# EAGLE schematic F (EAGLE 9.6.2)
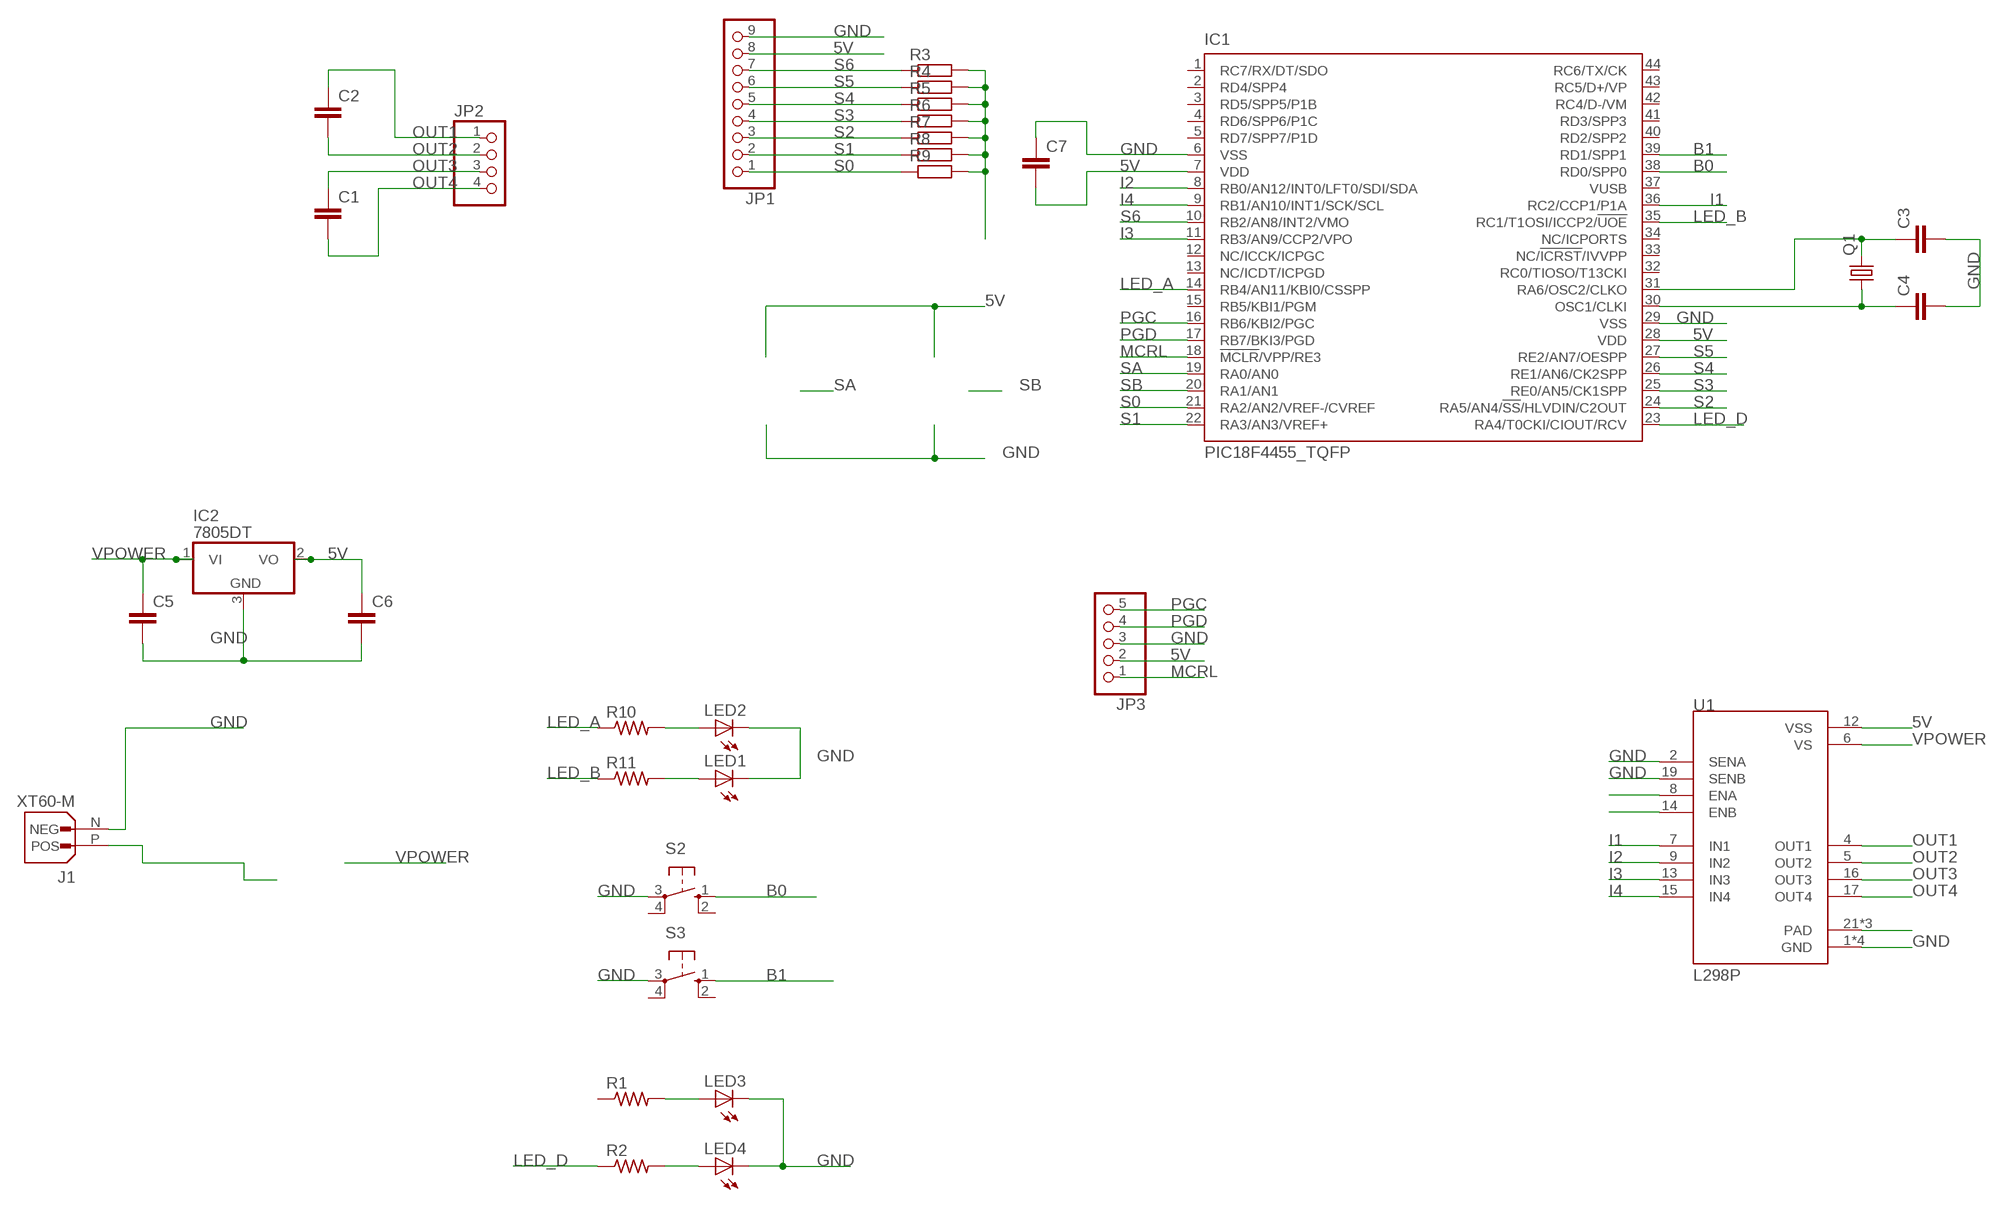
[diagram p0: schematic, sheet 1]

## Parts
C1  C2,5-3  [C2.5-3]
C2  C2,5-3  [C2.5-3]
C3  C2,5-3  [C2.5-3]
C4  C2,5-3  [C2.5-3]
C5  C2,5-3  [C2.5-3]
C6  C2,5-3  [C2.5-3]
C7  C2,5-3  [C2.5-3]
IC1  PIC18F4455_TQFP  [TQFP44]
IC2  7805DT  [TO252]
J1  XT60-M  [AMASS_XT60-M]
JP1  PINHD-1X9  [1X09]
JP2  PINHD-1X4  [1X04]
JP3  PINHD-1X5  [1X05]
LED1  LEDCHIPLED_1206  [CHIPLED_1206]
LED2  LEDCHIPLED_1206  [CHIPLED_1206]
LED3  LEDCHIPLED_1206  [CHIPLED_1206]
LED4  LEDCHIPLED_1206  [CHIPLED_1206]
Q1  CRYSTALHC49S  [HC49/S]
R1  R-US_R0805  [R0805]
R2  R-US_R0805  [R0805]
R3  R-EU_M0805  [M0805]
R4  R-EU_M0805  [M0805]
R5  R-EU_M0805  [M0805]
R6  R-EU_M0805  [M0805]
R7  R-EU_M0805  [M0805]
R8  R-EU_M0805  [M0805]
R9  R-EU_M0805  [M0805]
R10  R-US_M0805  [M0805]
R11  R-US_M0805  [M0805]
S2  10-XX  [B3F-10XX]
S3  10-XX  [B3F-10XX]
U1  L298P  [SOIC127P1420X360-20N]

## Nets
5V: C6.1 C7.2 IC1.7(VDD) IC1.28(VDD) IC2.2(VO) JP1.8 JP3.2 R3.2 R4.2 R5.2 R6.2 R7.2 R8.2 R9.2 U1.12(VSS)
B0: IC1.38(RD0/SPP0) S2.1(S)
B1: IC1.39(RD1/SPP1) S3.1(S)
GND: C3.2 C4.2 C5.2 C6.2 C7.1 IC1.6(VSS) IC1.29(VSS) IC2.3(GND) J1.N(NEG) JP1.9 JP3.3 LED1.C LED2.C LED3.C LED4.C S2.3(P) S3.3(P) U1.1(GND) U1.2(SENA) U1.10(GND) U1.11(GND) U1.19(SENB) U1.20(GND)
I1: IC1.36(RC2/CCP1/P1A) U1.7(IN1)
I2: IC1.8(RB0/AN12/INT0/LFT0/SDI/SDA) U1.9(IN2)
I3: IC1.11(RB3/AN9/CCP2/VPO) U1.13(IN3)
I4: IC1.9(RB1/AN10/INT1/SCK/SCL) U1.15(IN4)
LED_A: IC1.14(RB4/AN11/KBI0/CSSPP) R10.1
LED_B: IC1.35(RC1/T1OSI/ICCP2/!UOE) R11.1
LED_D: IC1.23(RA4/T0CKI/CIOUT/RCV) R2.1
MCRL: IC1.18(!MCLR!/VPP/RE3) JP3.1
N$17: C4.1 IC1.30(OSC1/CLKI) Q1.1
N$18: C3.1 IC1.31(RA6/OSC2/CLKO) Q1.2
N$20: LED2.A R10.2
N$21: LED1.A R11.2
N$24: LED3.A R1.2
N$25: LED4.A R2.2
N$26: U1.21(PAD) U1.22(PAD) U1.23(PAD)
N$27: U1.8(ENA)
N$28: U1.14(ENB)
OUT1: C2.1 JP2.1 U1.4(OUT1)
OUT2: C2.2 JP2.2 U1.5(OUT2)
OUT3: C1.1 JP2.3 U1.16(OUT3)
OUT4: C1.2 JP2.4 U1.17(OUT4)
PGC: IC1.16(RB6/KBI2/PGC) JP3.5
PGD: IC1.17(RB7/BKI3/PGD) JP3.4
S0: IC1.21(RA2/AN2/VREF-/CVREF) JP1.1 R9.1
S1: IC1.22(RA3/AN3/VREF+) JP1.2 R8.1
S2: IC1.24(RA5/AN4/!SS!/HLVDIN/C2OUT) JP1.3 R7.1
S3: IC1.25(RE0/AN5/CK1SPP) JP1.4 R6.1
S4: IC1.26(RE1/AN6/CK2SPP) JP1.5 R5.1
S5: IC1.27(RE2/AN7/OESPP) JP1.6 R4.1
S6: IC1.10(RB2/AN8/INT2/VMO) JP1.7 R3.1
SA: IC1.19(RA0/AN0)
SB: IC1.20(RA1/AN1)
VPOWER: C5.1 IC2.1(VI) U1.6(VS)
VPREV: J1.P(POS)
Unconnected: IC1.1(RC7/RX/DT/SDO) IC1.2(RD4/SPP4) IC1.3(RD5/SPP5/P1B) IC1.4(RD6/SPP6/P1C) IC1.5(RD7/SPP7/P1D) IC1.12(NC/ICCK/ICPGC) IC1.13(NC/ICDT/ICPGD) IC1.15(RB5/KBI1/PGM) IC1.32(RC0/TIOSO/T13CKI) IC1.33(NC/!ICRST!/IVVPP) IC1.34(NC/ICPORTS) IC1.37(VUSB) IC1.40(RD2/SPP2) IC1.41(RD3/SPP3) IC1.42(RC4/D-/VM) IC1.43(RC5/D+/VP) IC1.44(RC6/TX/CK) R1.1 S2.2(S1) S2.4(P1) S3.2(S1) S3.4(P1)

## Library data of the parts
C1-C7 = capacitor-wima:C: CAPACITOR naming: grid - package width
IC1 = microchip:PIC18F4*_TQFP: USB Microcontrollers with nanoWatt Technology High-Performance, Enhanced Flash, 28/40/44-Pin, Source: http://ww1.microchip.com/downloads/en/devicedoc/39632c.pdf; MF: MICROCHIP; MPN: PIC18F4455-I/PT; OC_FARNELL: 9321322; OC_NEWARK: 08J9628
IC2 = linear:78*: Positive VOLTAGE REGULATOR Source: http://cache.national.com/ds/LM/LM78L05.pdf http://www.fairchildsemi.com/ds/LM/LM7805.pdf
J1 = XT60-M:XT60-M: Check availability <https://pricing.snapeda.com/parts/XT60-M/AMASS/view-part?ref=eda>; AVAILABILITY: Not in stock; CHECK_PRICES: https://www.snapeda.com/parts/XT60-M/AMASS/view-part/?ref=eda; DESCRIPTION: Plug; DC supply; XT60; male; PIN: 2; for cable; soldered; 30A; 500V; MF: AMASS; MP: XT60-M; PACKAGE: Package; PRICE: None; SNAPEDA_LINK: https://www.snapeda.com/parts/XT60-M/AMASS/view-part/?ref=snap
JP1 = pinhead:PINHD-1X9: PIN HEADER
JP2 = pinhead:PINHD-1X4: PIN HEADER
JP3 = pinhead:PINHD-1X5: PIN HEADER
LED1-LED4 = adafruit:LED: LED OSRAM: - CHIPLED LG R971, LG N971, LY N971, LG Q971, LY Q971, LO R971, LY R971 LH N974, LH R974 LS Q976, LO Q976, LY Q976 LO Q996 - Hyper CHIPLED LW Q18S LB Q993, LB Q99A, LB R99A - SideLED LS A670, LO A670, LY A670, LG A670, LP A670 LB A673, LV A673, LT A673, LW A673 LH A674 LY A675 LS A676, LA A676, LO A676, LY A676, LW A676 LS A679, LY A679, LG A679 - Hyper Micro SIDELED® LS Y876, LA Y876, LO Y876, LY Y876 LT Y87S - SmartLED LW L88C, LW L88S LB L89C, LB L89S, LG L890 LS L89K, LO L89K, LY L89K LS L896, LA L896, LO L896, LY L896 - TOPLED LS T670, LO T670, LY T670, LG T670, LP T670 LSG T670, LSP T670, LSY T670, LOP T670, LYG T670 LG T671, LOG T671, LSG T671 LB T673, LV T673, LT T673, LW T673 LH T674 LS T676, LA T676, LO T676, LY T676, LB T676, LH T676, LSB T676, LW T676 LB T67C, LV T67C, LT T67C, LS T67K, LO T67K, LY T67K, LW E67C LS E67B, LA E67B, LO E67B, LY E67B, LB E67C, LV E67C, LT E67C LW T67C LS T679, LY T679, LG T679 LS T770, LO T770, LY T770, LG T770, LP T770 LB T773, LV T773, LT T773, LW T773 LH T774 LS E675, LA E675, LY E675, LS T675 LS T776, LA T776, LO T776, LY T776, LB T776 LHGB T686 LT T68C, LB T68C - Hyper Mini TOPLED® LB M676 - Mini TOPLED Santana® LG M470 LS M47K, LO M47K, LY M47K Source: http://www.osram.convergy.de/
Q1 = crystal:CRYSTAL: CRYSTAL; OC_FARNELL: 1667008; OC_NEWARK: unknown
R1 R2 = resistor:R-US_: RESISTOR, American symbol
R3-R9 = resistor:R-EU_: RESISTOR, European symbol
R10 R11 = adafruit:R-US_: RESISTOR, American symbol
S2 S3 = switch-omron:10-XX: OMRON SWITCH; MPN: B3F-1000; OC_FARNELL: 176432; OC_NEWARK: 36M3542
U1 = L298P:L298P: L298 Series Dual Full Bridge 4 A 46 V Driver Surface Mount - PowerSO-20 Check availability <https://pricing.snapeda.com/parts/L298P/STMicroelectronics/view-part?ref=eda>; AVAILABILITY: In Stock; CHECK_PRICES: https://www.snapeda.com/parts/L298P/STMicroelectronics/view-part/?ref=eda; DESCRIPTION: Half Bridge (4) Driver DC Motors, Relays, Solenoids, Stepper Motors Bipolar PowerSO-20; MF: STMicroelectronics; MP: L298P; PACKAGE: SO-20 STMicroelectronics; PRICE: None; PURCHASE-URL: https://www.snapeda.com/api/url_track_click_mouser/?unipart_id=41344&manufacturer=STMicroelectronics&part_name=L298P&search_term=None; SNAPEDA_LINK: https://www.snapeda.com/parts/L298P/STMicroelectronics/view-part/?ref=snap